# Altium project PRJ_SOLDER_HOTAIR_STATION_V1.0_06052016.PrjPcb
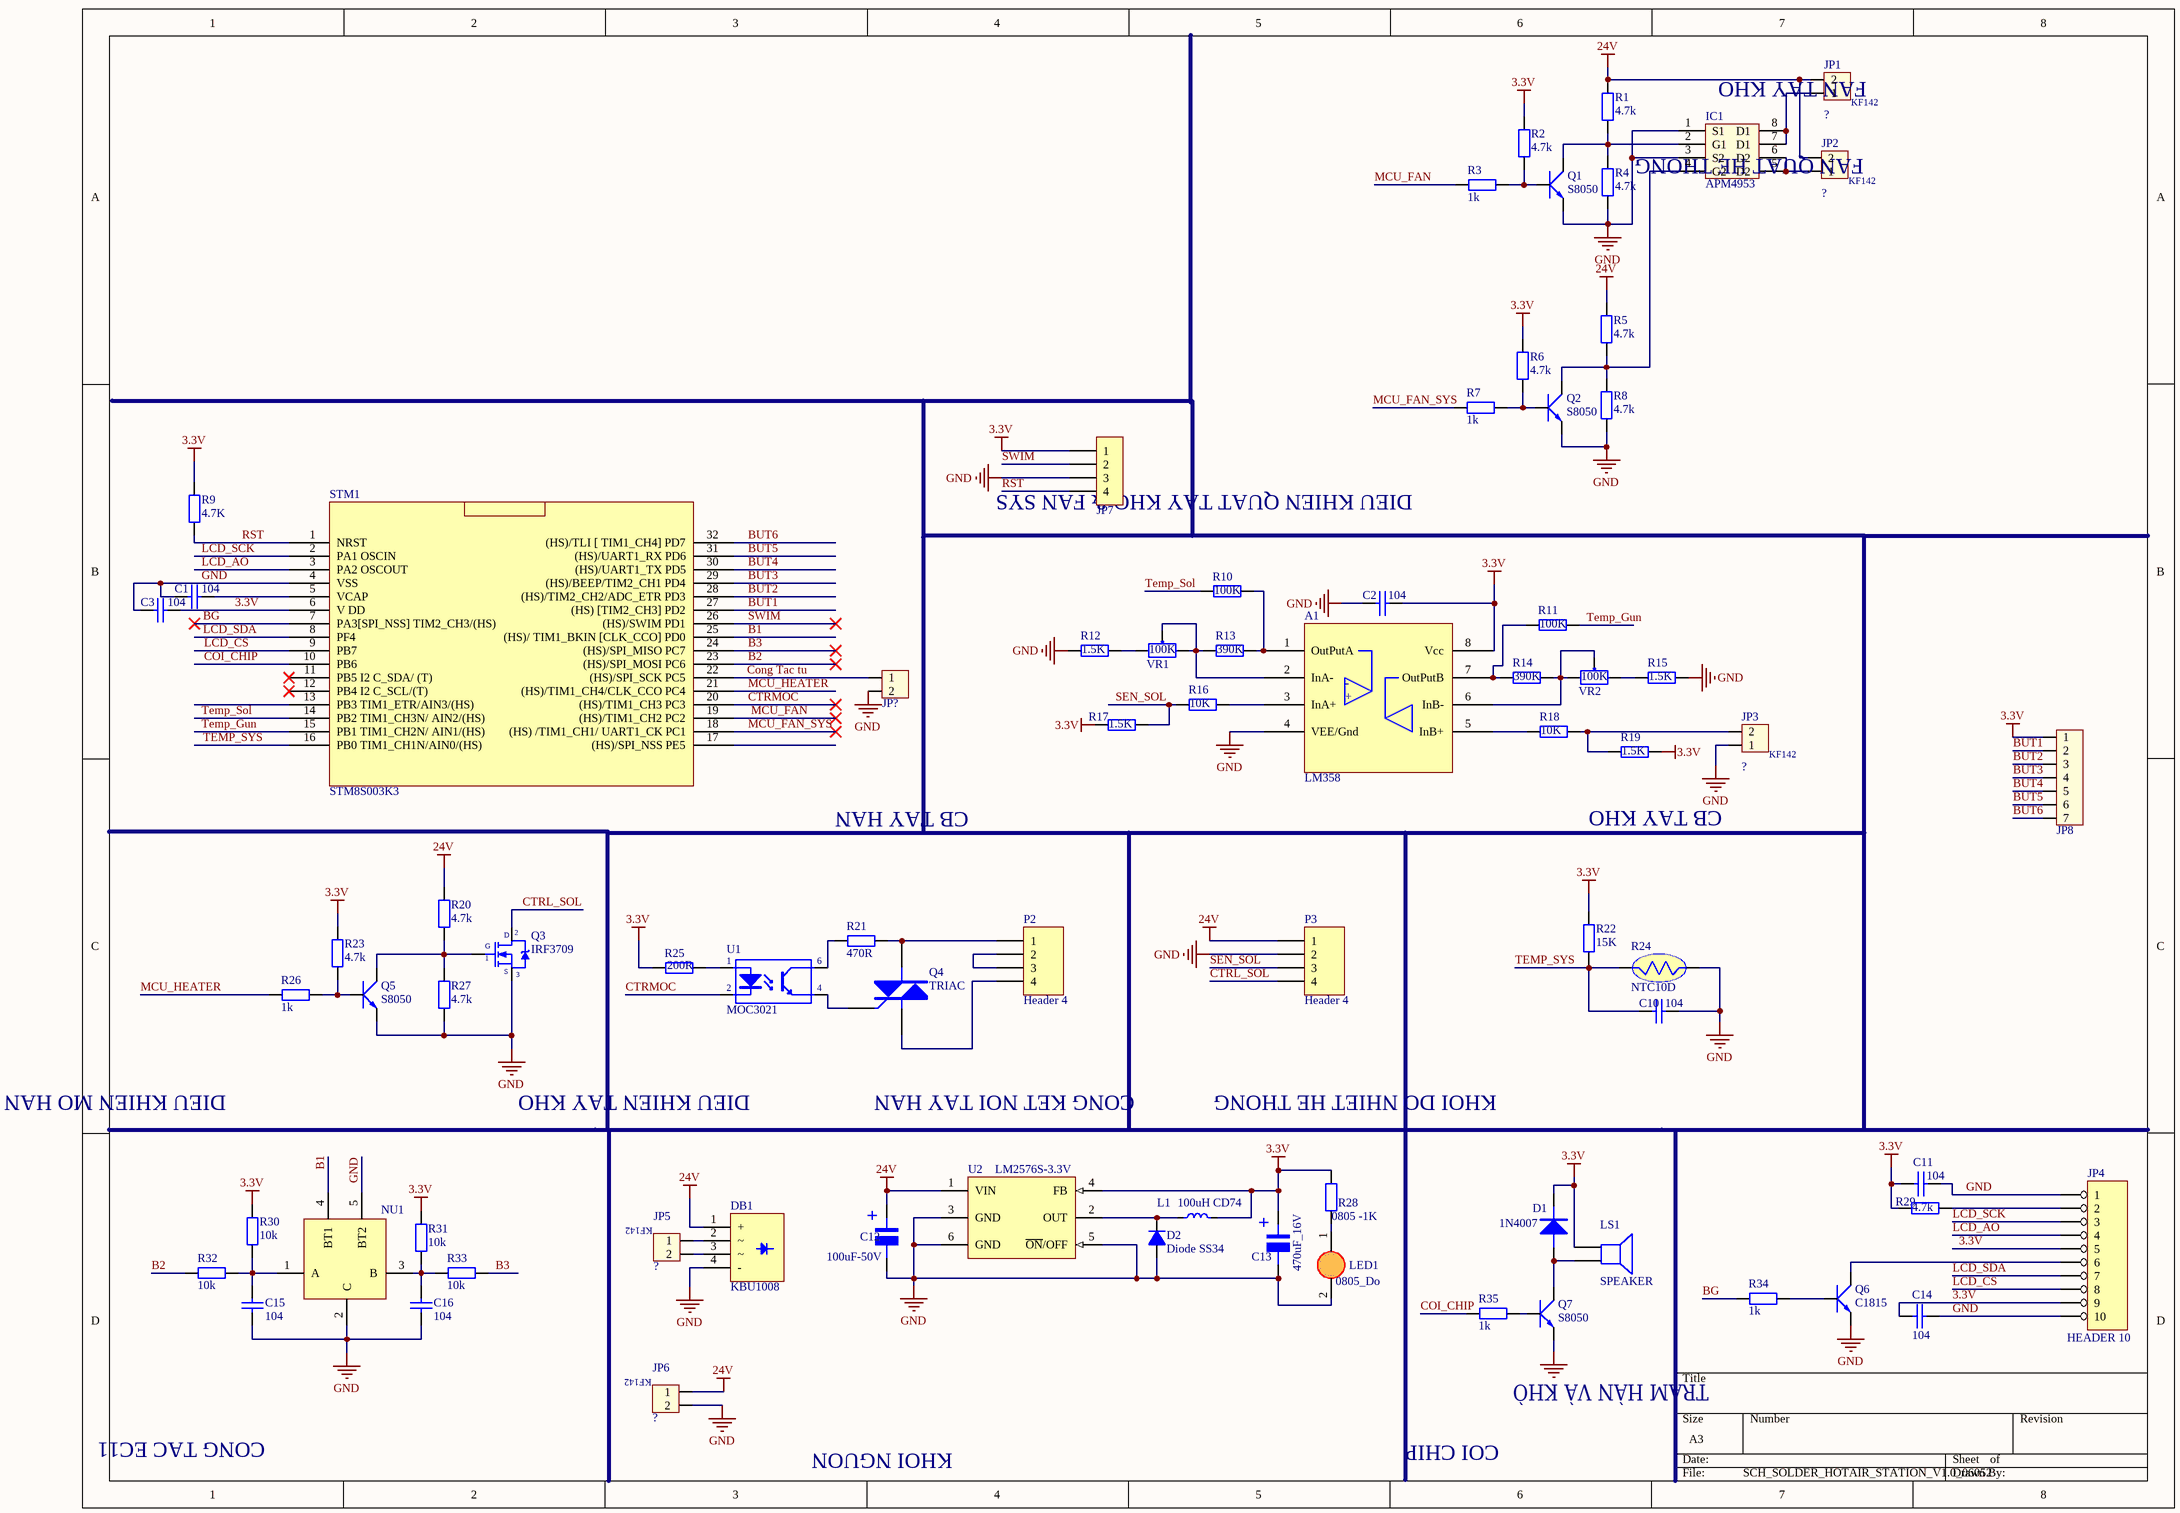
[diagram p0: SCH_SOLDER_HOTAIR_STATION_V1.0_06052016.SchDoc]
1 sheet, 77 parts. Net scope: global (net labels, ports and power ports of the same name join across sheets).
Board file: PCB_SOLDER_HOTAIR_STATION_V1.0_06052016.PcbDoc

## Sheet SCH_SOLDER_HOTAIR_STATION_V1.0_06052016.SchDoc
size A3

### Parts
A1  LM358  [SO-8N]
C1  104  [Tu 0805]
C2  104  [Tu 0805]
C3  104  [Tu 0805]
C10  104  [Tu 0805]
C11  104  [Tu 0805]
C12  Tu Nhom: 100uF-50V  [CAP1000uF25V]  (hidden comment: Tu Nhom 100uF - 50V)
C13  Tu Nhom: 470uF_16V  [CAP1000uF25V]  (hidden comment: Tu Nhom 470uF - 16V)
C14  104  [Tu 0805]
C15  104  [Tu 0805]
C16  104  [Tu 0805]
D1  1N4007  [DO - SMB]
D2  Diode SS34  [DO - SMB]
DB1  KBU1008  [DIODE BRIDGE(FLAT)]
IC1  APM4953  [SO-8]
JP1  ?  [Con 2 KF301 5.08]
JP2  ?  [Con 2 KF301 5.08]
JP3  ?  [Con 2 KF301 5.08]
JP4  HEADER 10  [HDR1x10  2.0MM]
JP5  ?  [CON 2 EDG 5.08]
JP6  ?  [CON 2 EDG 5.08]
JP7  Jump 1x4 DT 2.54  [HDR1X4]  (value not drawn)
JP8  Jump 1x7 DT 2.54  [HDR1X7]  (value not drawn)
JP?  Jump 1x2 DT 2.54  [HDR1X2]  (value not drawn)
L1  100uH CD74  [Cuon Cam 7.5x7x5]
LED1  LED0805 Màu Do  [LED 3mm Do]  (value not drawn)
LS1  SPEAKER  [SPEAKER]
NU1  Num Xoay EC11  [Num Xoay EC11]  (value not drawn)
P2  Header 4  [Con 4 KF301 5.08]
P3  Header 4  [Con 4 KF301 5.08]
Q1  S8050  [SOT23B]
Q2  S8050  [SOT23B]
Q3  IRF3709  [TO_263_2]
Q4  TRIAC  [QTO-220H3]
Q5  S8050  [SOT23B]
Q6  C1815  [SOT23B]
Q7  S8050  [SOT23B]
R1  4.7k  [Tro SMD 0805]
R2  4.7k  [Tro SMD 0805]
R3  1k  [Tro SMD 0805]
R4  4.7k  [Tro SMD 0805]
R5  4.7k  [Tro SMD 0805]
R6  4.7k  [Tro SMD 0805]
R7  1k  [Tro SMD 0805]
R8  4.7k  [Tro SMD 0805]
R9  4.7K  [Tro SMD 0805]
R10  100K  [Tro SMD 0805]
R11  100K  [Tro SMD 0805]
R12  1.5K  [Tro SMD 0805]
R13  390K  [Tro SMD 0805]
R14  390K  [Tro SMD 0805]
R15  1.5K  [Tro SMD 0805]
R16  10K  [Tro SMD 0805]
R17  1.5K  [Tro SMD 0805]
R18  10K  [Tro SMD 0805]
R19  1.5K  [Tro SMD 0805]
R20  4.7k  [Tro SMD 0805]
R21  470R  [Tro SMD 0805]
R22  15K  [Tro SMD 0805]
R23  4.7k  [Tro SMD 0805]
R24  NTC10D  [NTC MF52T]
R25  value 200R  [Tro SMD 0805]  (hidden comment: Tro 0805 5% 200R)
R26  1k  [Tro SMD 0805]
R27  4.7k  [Tro SMD 0805]
R28  value 0805 -1K  [Tro SMD 0805]  (hidden comment: Tro 0805 1K 5%)
R29  value 4.7k  [Tro SMD 0805]  (hidden comment: Tro 0805 4.7k)
R30  10k  [Tro SMD 0805]
R31  10k  [Tro SMD 0805]
R32  10k  [Tro SMD 0805]
R33  10k  [Tro SMD 0805]
R34  value 1k  [Tro SMD 0805]  (hidden comment: Tro 0805 1k)
R35  value 1k  [Tro SMD 0805]  (hidden comment: Tro 0805 1k)
STM1  STM8S003K3  [32A_M]
U1  MOC3021  [DIP6]
U2  LM2576S-3.3V  [TO263-5]
VR1  100K  [RVAR10K]
VR2  100K  [RVAR10K]

### Nets
3.3V: A1.8(Vcc) C2.1 C3.1 C11.2 C13.1 C14.2 D1.2 JP4.5 JP4.9 JP7.1 JP8.1 L1.2 LS1.1 R2.2 R6.2 R9.1 R17.1 R19.1 R22.1 R23.2 R25.1 R28.2 R29.2 R30.1 R31.1 STM1.6(V_DD) U2.4(FB)
24V: C12.1 DB1.1(+) JP1.2 JP2.2 JP6.1 P3.1 R1.1 R5.1 R20.1 U2.1(VIN)
GND: A1.4(VEE/Gnd) C1.2 C2.2 C3.2 C10.1 C11.1 C12.2 C13.2 C14.1 C15.2 C16.2 D2.1(A) DB1.4(-) IC1.1(S1) IC1.3(S2) JP3.1 JP4.1 JP4.10 JP6.2 JP7.3 JP?.2 LED1.2(K) NU1.2(C) NU1.5(BT2) P3.2 Q1.3(E) Q2.3(E) Q3.3(S) Q5.3(E) Q6.3(E) Q7.3(E) R4.2 R8.2 R12.2 R15.2 R24.2 R27.2 STM1.4(VSS) U2.3(GND) U2.5(~{ON}/OFF) U2.6(GND)
B1: NU1.4(BT1) STM1.25((HS)/_TIM1_BKIN_[CLK_CCO]_PD0)
B2: R32.1 STM1.23((HS)/SPI_MOSI_PC6)
B3: R33.2 STM1.24((HS)/SPI_MISO_PC7)
BG: R34.1 STM1.7(PA3[SPI_NSS]_TIM2_CH3/(HS))
BUT1: JP8.2 STM1.27((HS)_[TIM2_CH3]_PD2)
BUT2: JP8.3 STM1.28((HS)/TIM2_CH2/ADC_ETR_PD3)
BUT3: JP8.4 STM1.29((HS)/BEEP/TIM2_CH1_PD4)
BUT4: JP8.5 STM1.30((HS)/UART1_TX_PD5)
BUT5: JP8.6 STM1.31((HS)/UART1_RX_PD6)
BUT6: JP8.7 STM1.32((HS)/TLI_[_TIM1_CH4]_PD7)
COI_CHIP: R35.2 STM1.10(PB6)
Cong Tac tu: JP?.1 STM1.22((HS)/SPI_SCK_PC5)
CTRL_SOL: P3.4 Q3.2(D)
CTRMOC: STM1.20((HS)/TIM1_CH3_PC3) U1.2(K)
LCD_AO: JP4.4 STM1.3(PA2_OSCOUT)
LCD_CS: JP4.8 STM1.9(PB7)
LCD_SCK: JP4.3 STM1.2(PA1_OSCIN)
LCD_SDA: JP4.7 STM1.8(PF4)
MCU_FAN: R3.1 STM1.19((HS)/TIM1_CH2_PC2)
MCU_FAN_SYS: R7.1 STM1.18((HS)_/TIM1_CH1/_UART1_CK_PC1)
MCU_HEATER: R26.1 STM1.21((HS)/TIM1_CH4/CLK_CCO_PC4)
RST: JP7.4 R9.2 STM1.1(NRST)
SEN_SOL: P3.3 R16.2 R17.2
SWIM: JP7.2 STM1.26((HS)/SWIM_PD1)
Temp_Gun: R11.1 STM1.15(PB1_TIM1_CH2N/_AIN1/(HS))
Temp_Sol: R10.2 STM1.14(PB2_TIM1_CH3N/_AIN2/(HS))
TEMP_SYS: C10.2 R22.2 R24.1 STM1.16(PB0_TIM1_CH1N/AIN0/(HS))
NetA1_1: A1.1(OutPutA) R10.1 R13.1
NetA1_2: A1.2(InA-) R13.2 VR1.2 VR1.3
NetA1_3: A1.3(InA+) R16.1
NetA1_5: A1.5(InB+) R18.1
NetA1_6: A1.6(InB-) R14.2 VR2.2 VR2.3
NetA1_7: A1.7(OutPutB) R11.2 R14.1
NetC1_1: C1.1 STM1.5(VCAP)
NetC15_1: C15.1 NU1.1(A) R30.2 R32.2
NetC16_1: C16.1 NU1.3(B) R31.2 R33.1
NetD1_1: D1.1 LS1.2 Q7.2(C)
NetD2_2: D2.2(K) L1.1 U2.2(OUT)
NetDB1_2: DB1.2 JP5.1
NetDB1_3: DB1.3 JP5.2
NetIC1_2: IC1.2(G1) Q1.2(C) R1.2 R4.1
NetIC1_4: IC1.4(G2) Q2.2(C) R5.2 R8.1
NetIC1_5: IC1.5(D2) IC1.6(D2) JP2.1
NetIC1_7: IC1.7(D1) IC1.8(D1) JP1.1
NetJP3_2: JP3.2 R18.2 R19.2
NetJP4_2: JP4.2 R29.1
NetJP4_6: JP4.6 Q6.2(C)
NetLED1_1: LED1.1(A) R28.1
NetP2_1: P2.1 Q4.2(T) R21.2
NetP2_2: P2.2 P2.3
NetP2_4: P2.4 Q4.1(T)
NetQ1_1: Q1.1(B) R2.1 R3.2
NetQ2_1: Q2.1(B) R6.1 R7.2
NetQ3_1: Q3.1(G) Q5.2(C) R20.2 R27.1
NetQ4_3: Q4.3(G) U1.4(E)
NetQ5_1: Q5.1(B) R23.1 R26.2
NetQ6_1: Q6.1(B) R34.2
NetQ7_1: Q7.1(B) R35.1
NetR12_1: R12.1 VR1.1
NetR15_1: R15.1 VR2.1
NetR21_1: R21.1 U1.6(C)
NetR25_2: R25.2 U1.1(A)

Not connected (* = marked no-connect by the designer): STM1 11(PB5_I2_C_SDA/_(T))* 12(PB4_I2_C_SCL/(T))* 13(PB3_TIM1_ETR/AIN3/(HS)) 17((HS)/SPI_NSS_PE5)

### Notes on the sheet
- (near JP1) FAN TAY KHO
- (near JP2) FAN QUAT HE THONG
- DIEU KHIEN QUAT TAY KHO & FAN SYS
- CB TAY HAN
- CB TAY KHO
- DIEU KHIEN MO HAN
- DIEU KHIEN TAY KHO
- CONG KET NOI TAY HAN
- KHOI DO NHIET HE THONG
- TRẠM HÀN VÀ KHÒ
- CONG TAC EC11
- KHOI NGUON
- COI CHIP
- (in symbol Cap1000uF35V) +
- (in symbol KF142 2P) KF142
- (in symbol LED 3mm) 0805_Do
- (in symbol LM358) -; +

### Library data of the parts
C1-C3 C10 C11 C14 = CAP: Capacitor
C12 = Cap1000uF35V: [MH002223]Tu Nhom 100UF 50V 8x10.2MM
C13 = Cap1000uF35V: [MH001940]Tu Nhôm 470uF 16V 8x10.4MM
C15 C16 = Tu 0805: Tụ 0805
D1 = DIODE
D2 = D1A: [MH002104]Diode SS34 3A 40V SMA (Schottky 1N5822 3A); Value: Diode SS34
DB1 = Diode Bridge KBU1008: Diode Bridge
IC1 = APM4953: Dual P-Channel Enhancement Mode MOSFET
JP1-JP3 JP5 JP6 = KF142 2P: KF 142 2P; Value: Cam
JP7 = Jump 1x4 DT 2.54: Jump 1x4 đực thẳng 2.54; Value: cắm
JP8 = Jump 1x7 DT 2.54: Jump 1x7 đực thẳng 2.54; Value: cắm
JP? = Jump 1x2 DT 2.54: Jump 1x2 đực thẳng 2.54; Value: Cam
L1 = L100uH3A: [MH003999]Cuon Cam 100uH 7x7x4MM CD74
LED1 = LED 3mm: [MH000897] LED0805 Màu Do ( Red)
P2 P3 = Header 4: Header, 4-Pin; LatestRevisionDate: 17-Jul-2002; LatestRevisionNote: Re-released for DXP Platform.; Publisher: Altium Limited
Q1 Q2 Q5 Q7 = C1815: NPN 600mW, ECB; Value: C1815
Q3 = IRF840: MOSFET N - CHANNEL 500V - 0.75 - 8A - TO-220; Value: IRF840
Q6 = C1815: NPN 600mW, ECB; Value: C1815
R1-R20 R22 R23 R25-R27 R30-R33 R35 = Tro 0805
R21 = Tro 0805: Value: R1/4W - 1K
R28 = R1/4W: [R0805_1K] Tro 0805 1K 5%
R29 R34 = R1/4W: Resistor 0805
U1 = MOC3021: Single Opto; Value: MOC3021
U2 = LM2576T-5.0: [MH001260]LM2576S-5.0V BUCK 5V 3A TO263-5
VR1 VR2 = Var Resitor: Var Resistor; Value: VR 10K